# Altium schematic sheet SoM.SchDoc: Jetson Xavier NX Board
size A3; PageSetup: Record=PageOptions|CenterHorizontal=True|CenterVertical=True|PrintScale=0.97|XCorrection=1.00|YCorrection=1.00|PrintKind=1|BorderSize=5000000|LeftOffset=0|BottomOffset=0|Orientation=2|PaperLength=2970|PaperWidth=2100|Scale=100|PaperSource=7|PrintQuality=600|MediaType=1|DitherType=10|PaperKind=A4|PrintScaleMode=1; Organization: Altium Limited; Address1: 3 Minna Close; Address2: Belrose; Address3: NSW 2085; Address4: Australia; Revision: Rev01
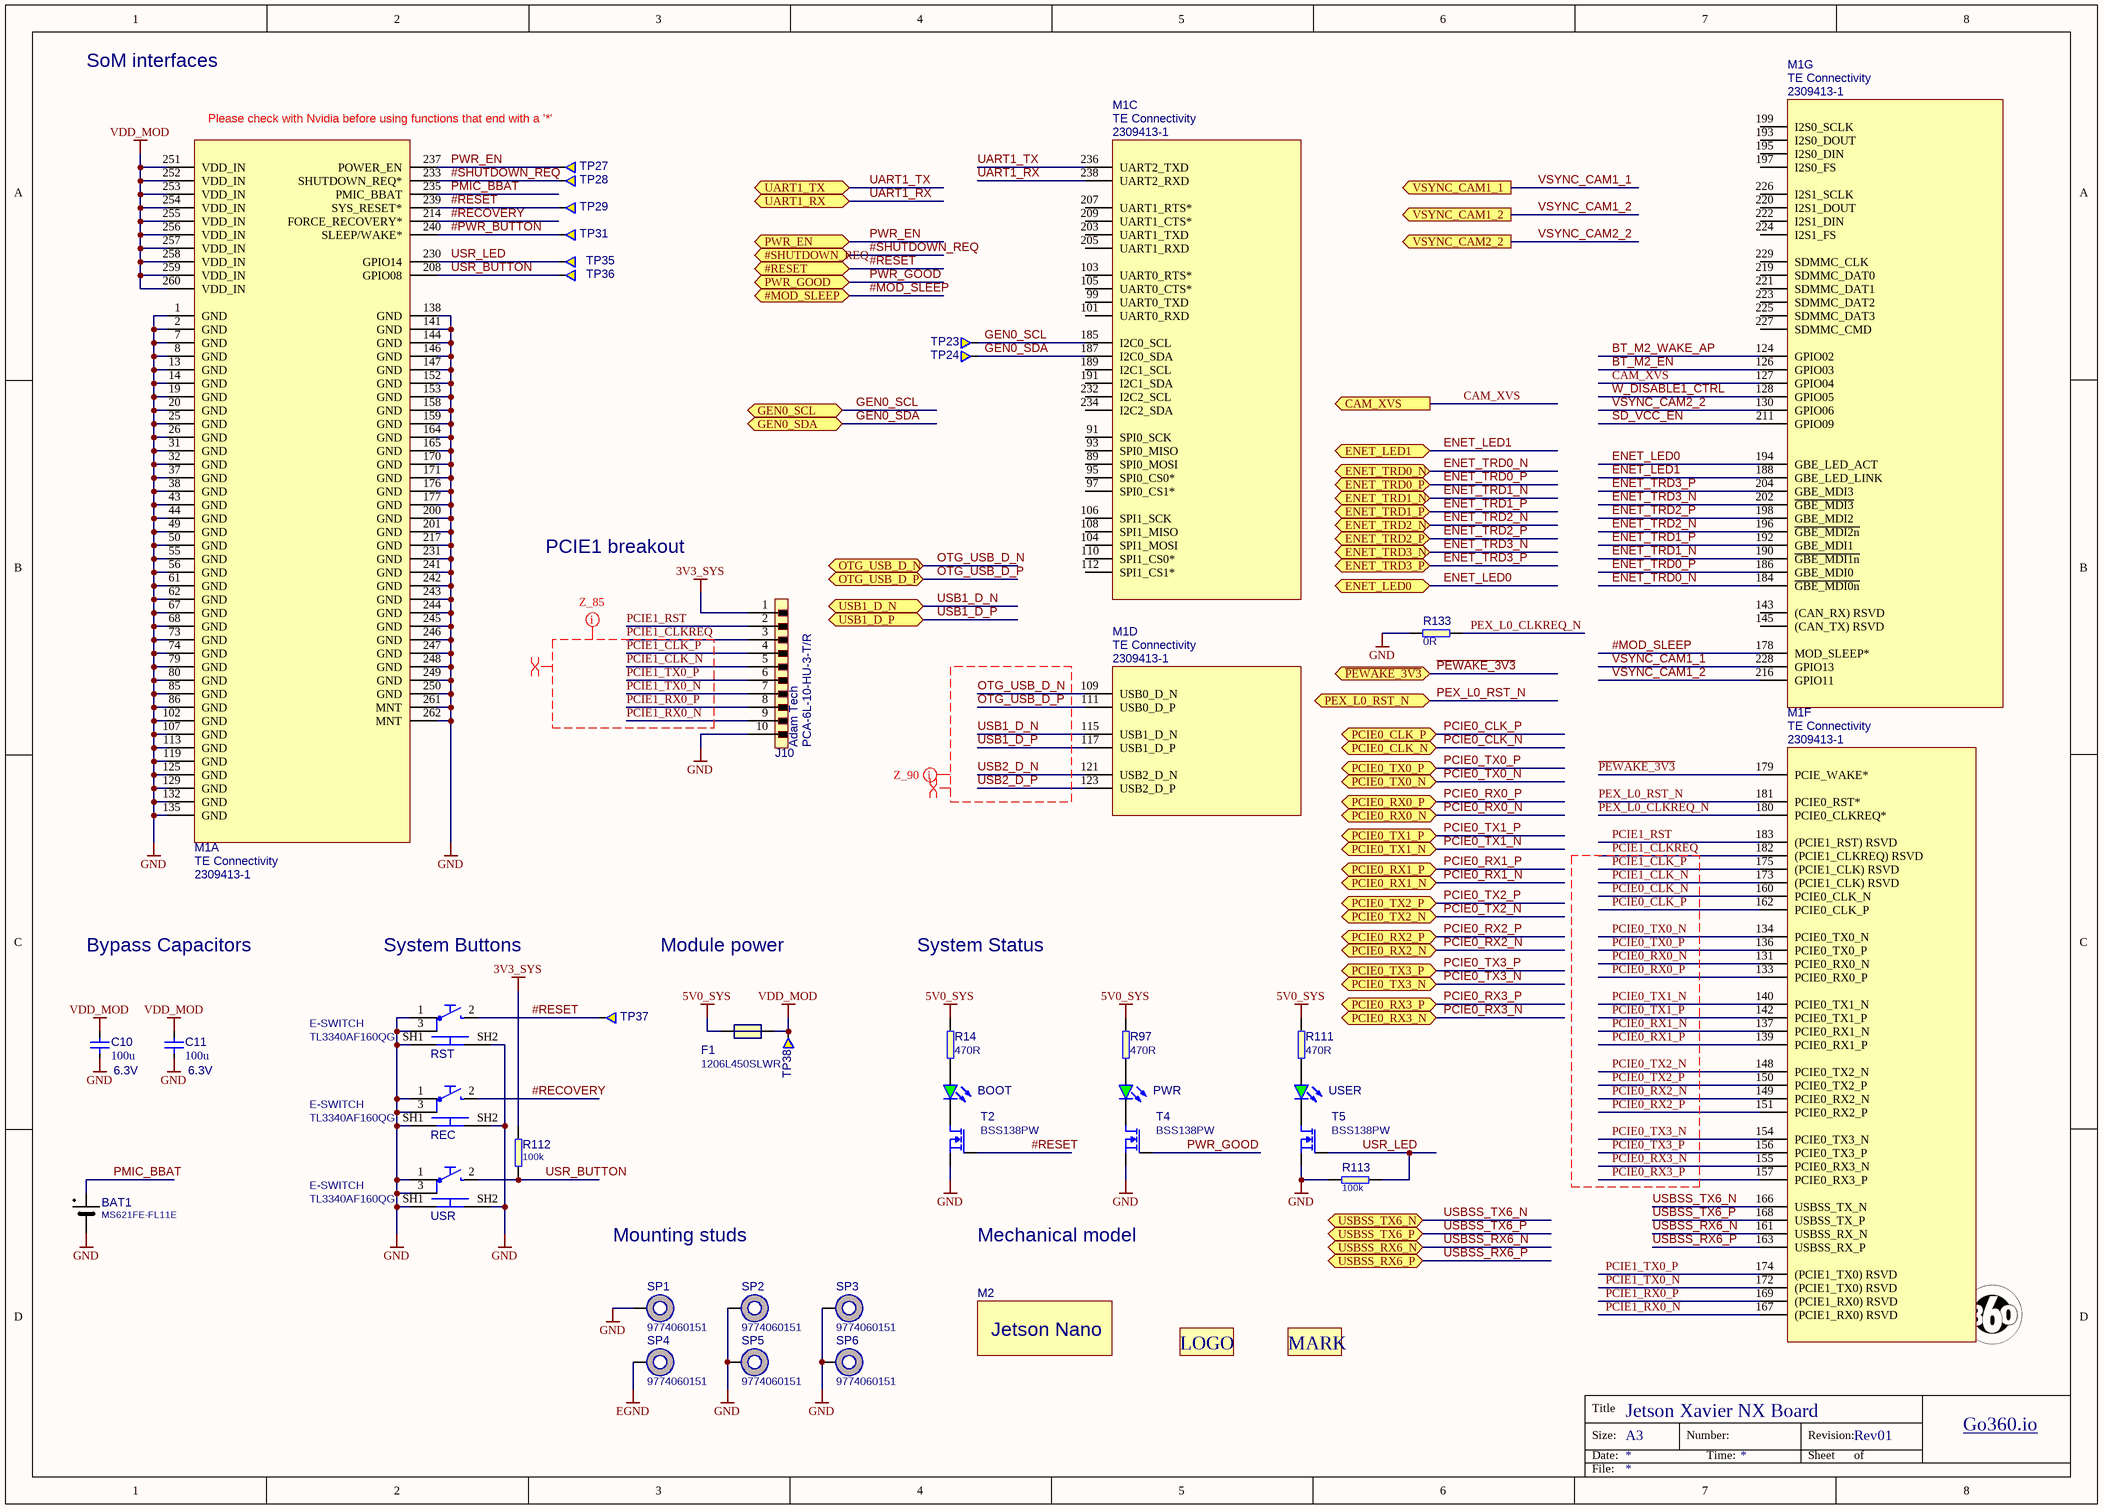
[diagram p0: SoM.SchDoc]

## Parts
BAT1  MS621FE-FL11E  [MS621FE-FL11E]
BOOT  KPT-1608SGC  [LED0603]  (value not drawn)
C10  Voltage: 6.3V  [1206]  (hidden comment: 100u)
C11  Voltage: 6.3V  [1206]  (hidden comment: 100u)
F1  PartSymbol: 1206L450SLWR  [Fuse-1206]  (hidden comment: Value)
J10  Manufacturer: Adam Tech  [PCA-10]  (hidden comment: PCA-6L-10-HU-3-T/R)
LOGO  LOGO  [LOGO_2]  (value not drawn)
M1  Manufacturer: TE Connectivity  [jetson-nano-connector]  (hidden comment: 2309413-1)  (parts A,C,D,F,G of 7)
M2  (no value)  [jetson-nano-module]
MARK  MARK  [MARK]  (value not drawn)
PWR  KPT-1608SGC  [LED0603]  (value not drawn)
R14  470R  [0402]
R97  470R  [0402]
R111  470R  [0402]
R112  100k  [0402]
R113  100k  [0402]
R133  0R  [0402]
REC  Manufacturer: E-SWITCH  [TL3340AF160QG]  (hidden comment: TL3340AF160QG)
RST  Manufacturer: E-SWITCH  [TL3340AF160QG]  (hidden comment: TL3340AF160QG)
SP1  9774060151  [M2.5-6mm]
SP2  9774060151  [M2.5-6mm]
SP3  9774060151  [M2.5-6mm]
SP4  9774060151  [M2.5-6mm]
SP5  9774060151  [M2.5-6mm]
SP6  9774060151  [M2.5-6mm]
T2  BSS138PW  [SC70-3]
T4  BSS138PW  [SC70-3]
T5  BSS138PW  [SC70-3]
TP23  Testpad  [TP-R-1.5]  (value not drawn)  (no BOM)
TP24  Testpad  [TP-R-1.5]  (value not drawn)  (no BOM)
TP27  Testpad  [TP-R-1.5]  (value not drawn)  (no BOM)
TP28  Testpad  [TP-R-1.5]  (value not drawn)  (no BOM)
TP29  Testpad  [TP-R-1.5]  (value not drawn)  (no BOM)
TP31  Testpad  [TP-R-1.5]  (value not drawn)  (no BOM)
TP35  Testpad  [TP-R-1.5]  (value not drawn)  (no BOM)
TP36  Testpad  [TP-R-1.5]  (value not drawn)  (no BOM)
TP37  Testpad  [TP-R-1.5]  (value not drawn)  (no BOM)
TP38  Testpad  [TP-R-1.5]  (value not drawn)  (no BOM)
USER  KPT-1608SGC  [LED0603]  (value not drawn)
USR  Manufacturer: E-SWITCH  [TL3340AF160QG]  (hidden comment: TL3340AF160QG)

## Ports
#MOD_SLEEP, #RESET, #SHUTDOWN_REQ, CAM_XVS (out), ENET_LED0, ENET_LED1, ENET_TRD0_N, ENET_TRD0_P, ENET_TRD1_N, ENET_TRD1_P, ENET_TRD2_N, ENET_TRD2_P, ENET_TRD3_N, ENET_TRD3_P, GEN0_SCL, GEN0_SDA, OTG_USB_D_N, OTG_USB_D_P, PCIE0_CLK_N, PCIE0_CLK_P, PCIE0_RX0_N, PCIE0_RX0_P, PCIE0_RX1_N, PCIE0_RX1_P, PCIE0_RX2_N, PCIE0_RX2_P, PCIE0_RX3_N, PCIE0_RX3_P, PCIE0_TX0_N, PCIE0_TX0_P, PCIE0_TX1_N, PCIE0_TX1_P, PCIE0_TX2_N, PCIE0_TX2_P, PCIE0_TX3_N, PCIE0_TX3_P, PEX_L0_RST_N, PWR_EN, PWR_GOOD, UART1_RX, UART1_TX, USB1_D_N, USB1_D_P, USBSS_RX6_N, USBSS_RX6_P, USBSS_TX6_N, USBSS_TX6_P, VSYNC_CAM1_1 (out), VSYNC_CAM1_2 (out), VSYNC_CAM2_2 (out), ~{PEWAKE_3V3}

## Nets
3V3_SYS: J10.1 R112.2
5V0_SYS: F1.1 R14.2 R97.2 R111.2
EGND: SP4.1
GND: BAT1.- C10.1 C11.1 J10.10 M1.1(GND) M1.2(GND) M1.7(GND) M1.8(GND) M1.13(GND) M1.14(GND) M1.19(GND) M1.20(GND) M1.25(GND) M1.26(GND) M1.31(GND) M1.32(GND) M1.37(GND) M1.38(GND) M1.43(GND) M1.44(GND) M1.49(GND) M1.50(GND) M1.55(GND) M1.56(GND) M1.61(GND) M1.62(GND) M1.67(GND) M1.68(GND) M1.73(GND) M1.74(GND) M1.79(GND) M1.80(GND) M1.85(GND) M1.86(GND) M1.102(GND) M1.107(GND) M1.113(GND) M1.119(GND) M1.125(GND) M1.129(GND) M1.132(GND) M1.135(GND) M1.138(GND) M1.141(GND) M1.144(GND) M1.146(GND) M1.147(GND) M1.152(GND) M1.153(GND) M1.158(GND) M1.159(GND) M1.164(GND) M1.165(GND) M1.170(GND) M1.171(GND) M1.176(GND) M1.177(GND) M1.200(GND) M1.201(GND) M1.217(GND) M1.231(GND) M1.241(GND) M1.242(GND) M1.243(GND) M1.244(GND) M1.245(GND) M1.246(GND) M1.247(GND) M1.248(GND) M1.249(GND) M1.250(GND) M1.261(MNT) M1.262(MNT) R113.2 R133.2 REC.1 REC.3 REC.SH1 REC.SH2 RST.1 RST.3 RST.SH1 RST.SH2 SP1.1 SP2.1 SP3.1 SP5.1 SP6.1 T2.2(S) T4.2(S) T5.2(S) USR.1 USR.3 USR.SH1 USR.SH2
VDD_MOD: C10.2 C11.2 F1.2 M1.251(VDD_IN) M1.252(VDD_IN) M1.253(VDD_IN) M1.254(VDD_IN) M1.255(VDD_IN) M1.256(VDD_IN) M1.257(VDD_IN) M1.258(VDD_IN) M1.259(VDD_IN) M1.260(VDD_IN) TP38.1
#MOD_SLEEP: M1.178(MOD_SLEEP*) ; port #MOD_SLEEP
#PWR_BUTTON: M1.240(SLEEP/WAKE*) TP31.1
#RECOVERY: M1.214(FORCE_RECOVERY*) REC.2
#RESET: M1.239(SYS_RESET*) RST.2 T2.1(G) TP29.1 TP37.1 ; port #RESET
#SHUTDOWN_REQ: M1.233(SHUTDOWN_REQ*) TP28.1 ; port #SHUTDOWN_REQ
~{PEWAKE_3V3}: M1.179(PCIE_WAKE*) ; port ~{PEWAKE_3V3}
BT_M2_EN: M1.126(GPIO03)
BT_M2_WAKE_AP: M1.124(GPIO02)
CAM_XVS: M1.127(GPIO04) ; port CAM_XVS
ENET_LED0: M1.194(GBE_LED_ACT) ; port ENET_LED0
ENET_LED1: M1.188(GBE_LED_LINK) ; port ENET_LED1
ENET_TRD0_N: M1.184(~{GBE_MDI0n}) ; port ENET_TRD0_N
ENET_TRD0_P: M1.186(GBE_MDI0) ; port ENET_TRD0_P
ENET_TRD1_N: M1.190(~{GBE_MDI1n}) ; port ENET_TRD1_N
ENET_TRD1_P: M1.192(GBE_MDI1) ; port ENET_TRD1_P
ENET_TRD2_N: M1.196(~{GBE_MDI2n}) ; port ENET_TRD2_N
ENET_TRD2_P: M1.198(GBE_MDI2) ; port ENET_TRD2_P
ENET_TRD3_N: M1.202(~{GBE_MDI3}) ; port ENET_TRD3_N
ENET_TRD3_P: M1.204(GBE_MDI3) ; port ENET_TRD3_P
GEN0_SCL: M1.185(I2C0_SCL) TP23.1 ; port GEN0_SCL
GEN0_SDA: M1.187(I2C0_SDA) TP24.1 ; port GEN0_SDA
OTG_USB_D_N: M1.109(USB0_D_N) ; port OTG_USB_D_N
OTG_USB_D_P: M1.111(USB0_D_P) ; port OTG_USB_D_P
PCIE0_CLK_N: M1.160(PCIE0_CLK_N) ; port PCIE0_CLK_N
PCIE0_CLK_P: M1.162(PCIE0_CLK_P) ; port PCIE0_CLK_P
PCIE0_RX0_N: M1.131(PCIE0_RX0_N) ; port PCIE0_RX0_N
PCIE0_RX0_P: M1.133(PCIE0_RX0_P) ; port PCIE0_RX0_P
PCIE0_RX1_N: M1.137(PCIE0_RX1_N) ; port PCIE0_RX1_N
PCIE0_RX1_P: M1.139(PCIE0_RX1_P) ; port PCIE0_RX1_P
PCIE0_RX2_N: M1.149(PCIE0_RX2_N) ; port PCIE0_RX2_N
PCIE0_RX2_P: M1.151(PCIE0_RX2_P) ; port PCIE0_RX2_P
PCIE0_RX3_N: M1.155(PCIE0_RX3_N) ; port PCIE0_RX3_N
PCIE0_RX3_P: M1.157(PCIE0_RX3_P) ; port PCIE0_RX3_P
PCIE0_TX0_N: M1.134(PCIE0_TX0_N) ; port PCIE0_TX0_N
PCIE0_TX0_P: M1.136(PCIE0_TX0_P) ; port PCIE0_TX0_P
PCIE0_TX1_N: M1.140(PCIE0_TX1_N) ; port PCIE0_TX1_N
PCIE0_TX1_P: M1.142(PCIE0_TX1_P) ; port PCIE0_TX1_P
PCIE0_TX2_N: M1.148(PCIE0_TX2_N) ; port PCIE0_TX2_N
PCIE0_TX2_P: M1.150(PCIE0_TX2_P) ; port PCIE0_TX2_P
PCIE0_TX3_N: M1.154(PCIE0_TX3_N) ; port PCIE0_TX3_N
PCIE0_TX3_P: M1.156(PCIE0_TX3_P) ; port PCIE0_TX3_P
PCIE1_CLK_N: J10.5 M1.173((PCIE1_CLK)_RSVD)
PCIE1_CLK_P: J10.4 M1.175((PCIE1_CLK)_RSVD)
PCIE1_CLKREQ: J10.3 M1.182((PCIE1_CLKREQ)_RSVD)
PCIE1_RST: J10.2 M1.183((PCIE1_RST)_RSVD)
PCIE1_RX0_N: J10.9 M1.167((PCIE1_RX0)_RSVD)
PCIE1_RX0_P: J10.8 M1.169((PCIE1_RX0)_RSVD)
PCIE1_TX0_N: J10.7 M1.172((PCIE1_TX0)_RSVD)
PCIE1_TX0_P: J10.6 M1.174((PCIE1_TX0)_RSVD)
PEX_L0_CLKREQ_N: M1.180(PCIE0_CLKREQ*) R133.1
PEX_L0_RST_N: M1.181(PCIE0_RST*) ; port PEX_L0_RST_N
PMIC_BBAT: BAT1.+ M1.235(PMIC_BBAT)
PWR_EN: M1.237(POWER_EN) TP27.1 ; port PWR_EN
PWR_GOOD: T4.1(G) ; port PWR_GOOD
~{SD_VCC_EN}: M1.211(GPIO09)
UART1_RX: M1.238(UART2_RXD) ; port UART1_RX
UART1_TX: M1.236(UART2_TXD) ; port UART1_TX
USB1_D_N: M1.115(USB1_D_N) ; port USB1_D_N
USB1_D_P: M1.117(USB1_D_P) ; port USB1_D_P
USB2_D_N: M1.121(USB2_D_N)
USB2_D_P: M1.123(USB2_D_P)
USBSS_RX6_N: M1.161(USBSS_RX_N) ; port USBSS_RX6_N
USBSS_RX6_P: M1.163(USBSS_RX_P) ; port USBSS_RX6_P
USBSS_TX6_N: M1.166(USBSS_TX_N) ; port USBSS_TX6_N
USBSS_TX6_P: M1.168(USBSS_TX_P) ; port USBSS_TX6_P
USR_BUTTON: M1.208(GPIO08) R112.1 TP36.1 USR.2
USR_LED: M1.230(GPIO14) R113.1 T5.1(G) TP35.1
VSYNC_CAM1_1: M1.228(GPIO13) ; port VSYNC_CAM1_1
VSYNC_CAM1_2: M1.216(GPIO11) ; port VSYNC_CAM1_2
VSYNC_CAM2_2: M1.130(GPIO06) ; port VSYNC_CAM2_2
W_DISABLE1_CTRL: M1.128(GPIO05)
NetBOOT_A: BOOT.A R14.1
NetBOOT_K: BOOT.K T2.3(D)
NetPWR_A: PWR.A R97.1
NetPWR_K: PWR.K T4.3(D)
NetR111_1: R111.1 USER.A
NetT5_3: T5.3(D) USER.K

Not connected (* = marked no-connect by the designer): M1 89(SPI0_MOSI) 91(SPI0_SCK) 93(SPI0_MISO) 95(SPI0_CS0*) 97(SPI0_CS1*) 99(UART0_TXD) 101(UART0_RXD) 103(UART0_RTS*) 104(SPI1_MOSI) 105(UART0_CTS*) 106(SPI1_SCK) 108(SPI1_MISO) 110(SPI1_CS0*) 112(SPI1_CS1*) 143((CAN_RX)_RSVD) 145((CAN_TX)_RSVD) 189(I2C1_SCL) 191(I2C1_SDA) 193(I2S0_DOUT) 195(I2S0_DIN) 197(I2S0_FS) 199(I2S0_SCLK) 203(UART1_TXD) 205(UART1_RXD) 207(UART1_RTS*) 209(UART1_CTS*) 219(SDMMC_DAT0) 220(I2S1_DOUT) 221(SDMMC_DAT1) 222(I2S1_DIN) 223(SDMMC_DAT2) 224(I2S1_FS) 225(SDMMC_DAT3) 226(I2S1_SCLK) 227(SDMMC_CMD) 229(SDMMC_CLK) 232(I2C2_SCL) 234(I2C2_SDA)

## Layout directives
differential pair: OTG_USB_D_N, OTG_USB_D_P, PCIE1_CLK_N, PCIE1_CLK_P, PCIE1_CLKREQ, PCIE1_RX0_N, PCIE1_RX0_P, PCIE1_TX0_N, PCIE1_TX0_P, USB1_D_N, USB1_D_P, USB2_D_N, USB2_D_P
net class Z_90: OTG_USB_D_N, OTG_USB_D_P, USB1_D_N, USB1_D_P, USB2_D_N, USB2_D_P
net class Z_85: PCIE1_CLK_N, PCIE1_CLK_P, PCIE1_CLKREQ, PCIE1_RX0_N, PCIE1_RX0_P, PCIE1_TX0_N, PCIE1_TX0_P

## Notes on the sheet
- SoM interfaces
- PCIE1 breakout
- Bypass Capacitors
- System Buttons
- Module power
- System Status
- Mounting studs
- Mechanical model
- Title
- Size:
- Date:
- A3
- Number:
- Time:
- Revision:
- Sheet
- of
- Go360.io
- File:
- (in symbol jetson-nano-module) Jetson Nano
- (in symbol jetson-nano-new-release, part A) Please check with Nvidia before using functions that end with a '*'

## Library data of the parts
BAT1 = battery: Rechargeable Battery, Coin Cell, Single Cell, 3 V, Lithium Manganese Dioxide, 5.5 mAh, Button Cell; Manufacturer: SEIKO INSTRUMENTS; PartNumber: MS621FE-FL11E; Value: MS621FE-FL11E; PartSymbol: MS621FE-FL11E; Class: Battery
BOOT PWR USER = LED: LED Green 0603 case; PartNumber: LED_G; Manufacturer: KINGBRIGHT; Value: KPT-1608SGC; PartSymbol: KPT-1608SGC
C10 C11 = C_100u_1206: MLCC SMT Capacitor 100uF 1206; Manufacturer: KEMET; PartSymbol: C1206C107M9PACTU; PartNumber: C_100u_1206; Value: 100u
F1 = Fuse: PTC RESET 6V LO RHO 1206 4.50A; PartNumber: LITTELFUSE_1206L450SLWR; Manufacturer: LITTELFUSE; Value: 1206L450SLWR
J10 = PCA-10: RECEPTACLE, FPC, ZIF, SMT, 0.5MM, 10WAY, UP; PartNumber: PCA-6K-10-HU-3; Value: PCA-6L-10-HU-3-T/R; PartSymbol: PCA-6L-10-HU-3-T/R
M1 = jetson-nano-new-release: PartNumber: 2309413-1; PartSymbol: 2309413-1; Value: 2309413-1
M2 = jetson-nano-module: PartNumber: jetson-nano-module
R14 R97 R111 = R_470R_0402: RES, 470R, 0402; Manufacturer: VISHAY; PartSymbol: CRCW0402470RFKED.; PartNumber: R_470R_0402; Value: 470R
R112 R113 = R_100k_0402: SMT Resistor 100k 0402; Manufacturer: VISHAY; PartSymbol: CRCW0402100KFKEDHP; Tolerance: 1%; PartNumber: R_100k_0402; Value: 100k
R133 = R_0R_0402: RES, 0R, 0402; Manufacturer: Panasonic; PartSymbol: ERJ2GE0R00X; Value: 0R; PartNumber: R_0R_0402
REC RST USR = TL3340AF160QG: E-SWITCH  TL3340AF160QG  SWITCH, TACTILE SPST 50mA, SMD GULL WING; Value: TL3340AF160QG; PartNumber: TL3340AF160QG; PartSymbol: TL3340AF160QG
SP1-SP6 = SPACER: M2.5-6mm; PartNumber: M2.5x6; Manufacturer: WURTH ELEKTRONIK; Value: 9774060151; PartSymbol: 9774060151
T2 T4 T5 = NMOS: MOSFET, N CH, 60V, 0.2A; Manufacturer: NXP; Value: BSS138PW; PartNumber: BSS138PW; PartSymbol: BSS138PW
TP23 TP24 TP27-TP29 TP31 TP35-TP38 = Testpad: Testpad, round, 1.5mm; PartNumber: TP-R-1.5